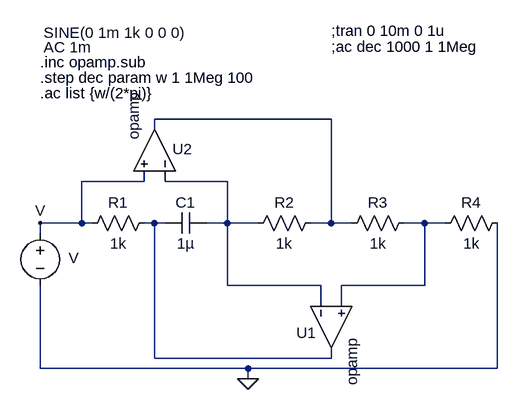
[diagram p0: schematic Ejercicio_5_A.asc]
Ejercicio_5_A.asc, the LTspice schematic file:
Version 4
SHEET 1 980 728
WIRE 512 160 240 160
WIRE 240 176 240 160
WIRE 224 256 224 240
WIRE 224 256 128 256
WIRE 256 256 256 240
WIRE 352 256 256 256
WIRE 128 320 128 256
WIRE 128 320 64 320
WIRE 144 320 128 320
WIRE 240 320 224 320
WIRE 256 320 240 320
WIRE 352 320 352 256
WIRE 352 320 320 320
WIRE 400 320 352 320
WIRE 512 320 512 160
WIRE 512 320 480 320
WIRE 544 320 512 320
WIRE 656 320 624 320
WIRE 688 320 656 320
WIRE 64 336 64 320
WIRE 352 416 352 320
WIRE 496 416 352 416
WIRE 656 416 656 320
WIRE 656 416 528 416
WIRE 496 448 496 416
WIRE 528 448 528 416
WIRE 240 528 240 320
WIRE 512 528 512 512
WIRE 512 528 240 528
WIRE 64 544 64 416
WIRE 384 544 64 544
WIRE 768 544 768 320
WIRE 768 544 384 544
WIRE 384 560 384 544
FLAG 384 560 0
FLAG 64 320 V
SYMBOL voltage 64 320 R0
WINDOW 123 5 -271 Left 2
WINDOW 39 0 0 Left 2
WINDOW 0 44 54 Left 2
WINDOW 3 5 -293 Left 2
SYMATTR Value2 AC 1m
SYMATTR InstName V
SYMATTR Value SINE(0 1m 1k 0 0 0)
SYMBOL res 496 304 R90
WINDOW 0 0 56 VBottom 2
WINDOW 3 32 56 VTop 2
SYMATTR InstName R2
SYMATTR Value 1k
SYMBOL res 240 304 R90
WINDOW 0 0 56 VBottom 2
WINDOW 3 32 56 VTop 2
SYMATTR InstName R1
SYMATTR Value 1k
SYMBOL res 640 304 R90
WINDOW 0 0 56 VBottom 2
WINDOW 3 32 56 VTop 2
SYMATTR InstName R3
SYMATTR Value 1k
SYMBOL cap 320 304 R90
WINDOW 0 0 32 VBottom 2
WINDOW 3 32 32 VTop 2
SYMATTR InstName C1
SYMATTR Value 1µ
SYMBOL Opamps\\opamp 448 480 M90
WINDOW 0 9 41 VLeft 2
SYMATTR InstName U1
SYMBOL Opamps\\opamp 304 208 M270
WINDOW 0 2 36 VLeft 2
SYMATTR InstName U2
SYMBOL res 784 304 R90
WINDOW 0 0 56 VBottom 2
WINDOW 3 32 56 VTop 2
SYMATTR InstName R4
SYMATTR Value 1k
TEXT 512 24 Left 2 !;tran 0 10m 0 1u
TEXT 512 48 Left 2 !;ac dec 1000 1 1Meg
TEXT 64 96 Left 2 !.step dec param w 1 1Meg 100
TEXT 64 120 Left 2 !.ac list {w/(2*pi)}
TEXT 64 72 Left 2 !.inc opamp.sub

The netlist it stands for:
* Ejercicio_5_A.asc
V V 0 SINE(0 1m 1k 0 0 0) AC 1m
R2 N001 N002 1k
R1 N003 V 1k
R3 N004 N001 1k
C1 N002 N003 1µ
XU1 N002 N004 N003 opamp Aol=100K GBW=10Meg  ; pins invin noninvin out
XU2 N002 V N001 opamp Aol=100K GBW=10Meg  ; pins invin noninvin out
R4 0 N004 1k
;tran 0 10m 0 1u
;ac dec 1000 1 1Meg
.step dec param w 1 1Meg 100
.ac list {w/(2*pi)}
.inc opamp.sub
.backanno
.end